# Altium project Michel.PrjPcb (part 2 of 2)

## Sheet PA1_Alim.SchDoc
size 254 x 228 mm
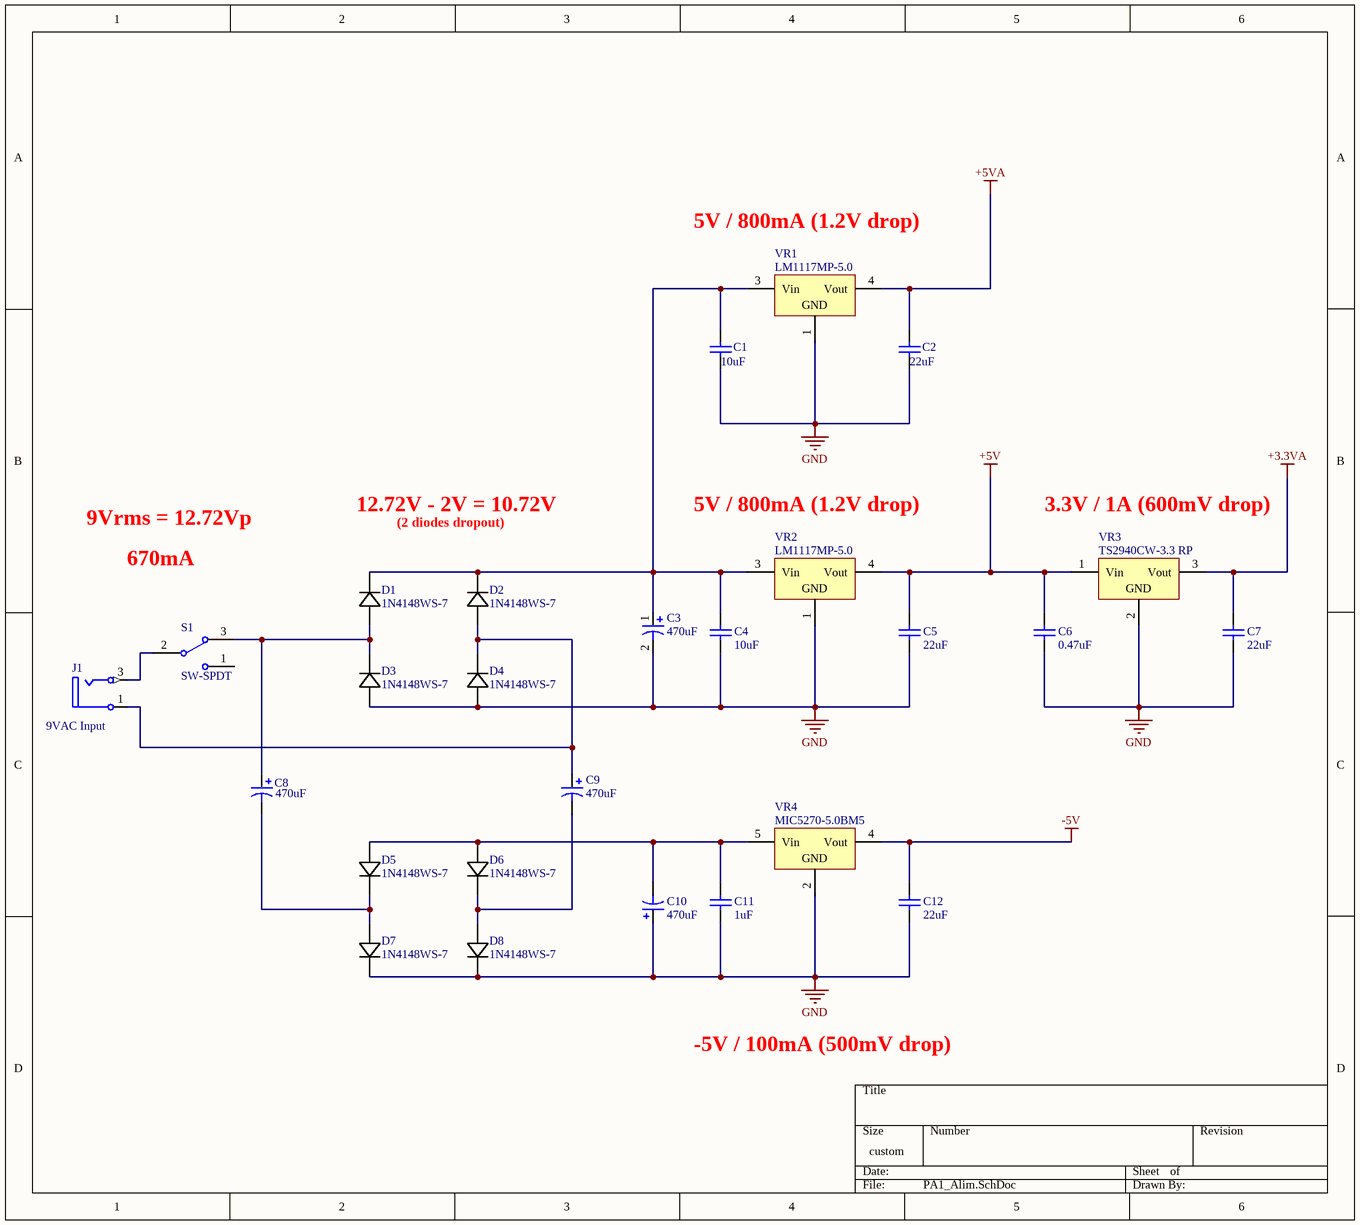
[diagram p6: PA1_Alim.SchDoc]

### Parts
C1  value 10uF  [CAPC1608X08]  (hidden comment: Cap 10uF)
C2  value 22uF  [CAPC1608X08]  (hidden comment: Cap 22uF)
C3  value 470uF  [CAPC100100X102]  (hidden comment: Cap 470uF)
C4  value 10uF  [CAPC1608X08]  (hidden comment: Cap 10uF)
C5  value 22uF  [CAPC1608X08]  (hidden comment: Cap 22uF)
C6  value 0.47uF  [CAPC1608X08]  (hidden comment: Cap 0.47uF)
C7  value 22uF  [CAPC1608X08]  (hidden comment: Cap 22uF)
C8  value 470uF  [CAPC100100X102]  (hidden comment: Cap 470uF)
C9  value 470uF  [CAPC100100X102]  (hidden comment: Cap 470uF)
C10  value 470uF  [CAPC100100X102]  (hidden comment: Cap 470uF)
C11  value 1uF  [CAPC1608X08]  (hidden comment: Cap 1uF)
C12  value 22uF  [CAPC1608X08]  (hidden comment: Cap 22uF)
D1  1N4148WS-7  [SOD323-M]
D2  1N4148WS-7  [SOD323-M]
D3  1N4148WS-7  [SOD323-M]
D4  1N4148WS-7  [SOD323-M]
D5  1N4148WS-7  [SOD323-M]
D6  1N4148WS-7  [SOD323-M]
D7  1N4148WS-7  [SOD323-M]
D8  1N4148WS-7  [SOD323-M]
J1  9VAC Input  [CLIFF ELECTRONIC COMPONENTS_FC681465P]
S1  SW-SPDT  [C&K_TS01ABE]
VR1  LM1117MP-5.0  [MP04A]
VR2  LM1117MP-5.0  [MP04A]
VR3  TS2940CW-3.3 RP  [SOT230P715X180-4N]
VR4  MIC5270-5.0BM5  [SOT95P280X130-5N]

### Nets
+3.3VA: C7.2 VR3.3(Vout)
+5V: C5.2 C6.2 VR2.4(Vout) VR3.1(Vin)
+5VA: C2.2 VR1.4(Vout)
-5V: C12.2 VR4.4(Vout)
GND: C1.1 C2.1 C3.2 C4.1 C5.1 C6.1 C7.1 C10.1 C11.1 C12.1 D3.2 D4.2 D7.1 D8.1 VR1.1(GND) VR2.1(GND) VR3.2(GND) VR4.2(GND)
NetC1_2: C1.2 C3.1 C4.2 D1.1 D2.1 VR1.3(Vin) VR2.3(Vin)
NetC8_1: C8.1 D1.2 D3.1 S1.3
NetC8_2: C8.2 D5.1 D7.2
NetC9_1: C9.1 D2.2 D4.1 J1.1(S)
NetC9_2: C9.2 D6.1 D8.2
NetC10_2: C10.2 C11.2 D5.2 D6.2 VR4.5(Vin)
NetJ1_3: J1.3(T) S1.2

Not connected (* = marked no-connect by the designer): S1 1

### Notes on the sheet
- 5V / 800mA (1.2V drop)
- 9Vrms = 12.72Vp
- 670mA
- 12.72V - 2V = 10.72V
- (2 diodes dropout)
- 3.3V / 1A (600mV drop)
- -5V / 100mA (500mV drop)

### Library data of the parts
C1 C4 = Cap Semi: Capacitor; Fabricant: TDK; Fournisseur: Farnell; RefFabricant: C1608X5R1A106M080AC; RefFournisseur: 2309028; Case: 0603 [1608 Metric]; DataSheet: http://www.farnell.com/datasheets/2291921.pdf
C2 C5 C7 C12 = Cap Semi: Capacitor; Fabricant: MURATA; Fournisseur: Farnell; RefFabricant: GRM188R61A226ME15D; RefFournisseur: 2426957; Case: 0603 [1608 Metric]; DataSheet: http://www.farnell.com/datasheets/2047978.pdf
C3 C8-C10 = Cap Pol1: Polarized Capacitor (Radial); Fabricant: PANASONIC ELECTRONIC COMPONENTS; Fournisseur: Farnell; RefFabricant: EEEFK1E471P; RefFournisseur: 9695800; Case: [10mm]; DataSheet: http://www.farnell.com/datasheets/2002520.pdf
C6 = Cap Semi: Capacitor; Fabricant: TDK; Fournisseur: Farnell; RefFabricant: C1608X5R1H474K080AB; RefFournisseur: 2211183; Case: 0603 [1608 Metric]; DataSheet: http://www.farnell.com/datasheets/2291921.pdf
C11 = Cap Semi: Capacitor; Fabricant: MURATA; Fournisseur: Farnell; RefFabricant: GRM188F51A105ZA01D; RefFournisseur: 1828847; Case: 0603 [1608 Metric]; DataSheet: http://www.farnell.com/datasheets/2048756.pdf
D1-D8 = 1N4148WS-7: Diode signaux faibles; RefFournisseur: 2453269; Fabricant: ON SEMICONDUCTOR; Fournisseur: Farnell; RefFabricant: 1N4148WS; DataSheet: http://www.farnell.com/datasheets/2288055.pdf
J1 = Phonejack2: Jack Socket Thru-Hole Vertical 2-Conductor Open Circuit; Fabricant: CLIFF ELECTRONIC COMPONENTS; Fournisseur: Farnell; RefFabricant: FC681465P; RefFournisseur: 1854512; DataSheet: http://www.farnell.com/datasheets/1855458.pdf
S1 = SW-SPDT: SPDT Subminiature Toggle Switch, Right Angle Mounting, Vertical Actuation; Fabricant: C & K COMPONENTS; Fournisseur: Farnell; RefFabricant: TS01ABE; RefFournisseur: 2435185; DataSheet: http://www.farnell.com/datasheets/1839865.pdf
VR1 VR2 = Volt Reg: Voltage Regulator; Fabricant: TEXAS INSTRUMENTS; Fournisseur: Farnell; RefFournisseur: 9778209; DataSheet: http://www.farnell.com/datasheets/2019100.pdf; RefFabricant: LM1117MP-5.0
VR3 = Volt Reg: Voltage Regulator; Fabricant: TAIWAN SEMICONDUCTOR; Fournisseur: Farnell; RefFournisseur: 7261403; DataSheet: http://www.farnell.com/datasheets/2044143.pdf; RefFabricant: TS2940CW-3.3 RP
VR4 = Volt Reg: Voltage Regulator; Fabricant: MICROCHIP; Fournisseur: Farnell; RefFabricant: MIC5270-5.0YM5-TR; RefFournisseur: 2510308; DataSheet: http://www.farnell.com/datasheets/29611.pdf

## Sheet PP4_pD_GND.SchDoc
size A
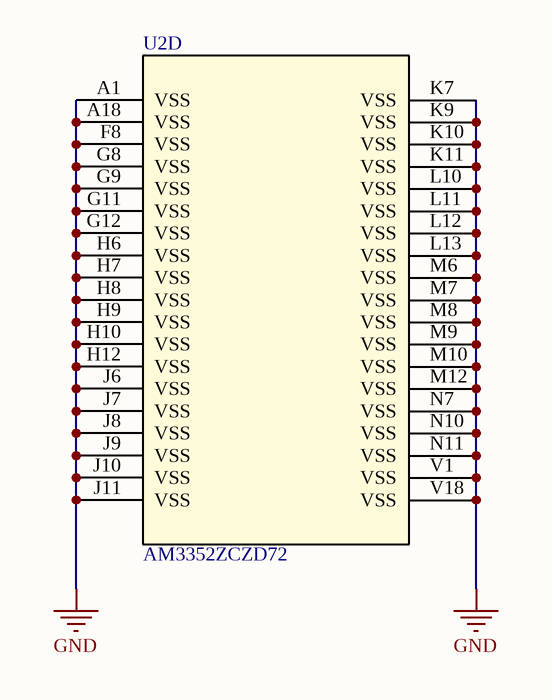
[diagram p7: PP4_pD_GND.SchDoc]

### Parts
U2  AM3352ZCZD72  [ZCZ324]  (part D of 4)

### Nets
GND: U2.A1(VSS) U2.A18(VSS) U2.F8(VSS) U2.G8(VSS) U2.G9(VSS) U2.G11(VSS) U2.G12(VSS) U2.H6(VSS) U2.H7(VSS) U2.H8(VSS) U2.H9(VSS) U2.H10(VSS) U2.H12(VSS) U2.J6(VSS) U2.J7(VSS) U2.J8(VSS) U2.J9(VSS) U2.J10(VSS) U2.J11(VSS) U2.K7(VSS) U2.K9(VSS) U2.K10(VSS) U2.K11(VSS) U2.L10(VSS) U2.L11(VSS) U2.L12(VSS) U2.L13(VSS) U2.M6(VSS) U2.M7(VSS) U2.M8(VSS) U2.M9(VSS) U2.M10(VSS) U2.M12(VSS) U2.N7(VSS) U2.N10(VSS) U2.N11(VSS) U2.V1(VSS) U2.V18(VSS)

### Library data of the parts
U2 = AM3352BZCZD80: Microprocesseur ARM; Fabricant: TEXAS INSTRUMENTS; Fournisseur: Olimex; RefFabricant: AM3352ZCZD72; RefFournisseur: AM3352ZCZD72; DataSheet: http://www.ti.com/lit/ds/symlink/am3352.pdf

## Sheet PP5_MIDI.SchDoc
size 152 x 152 mm
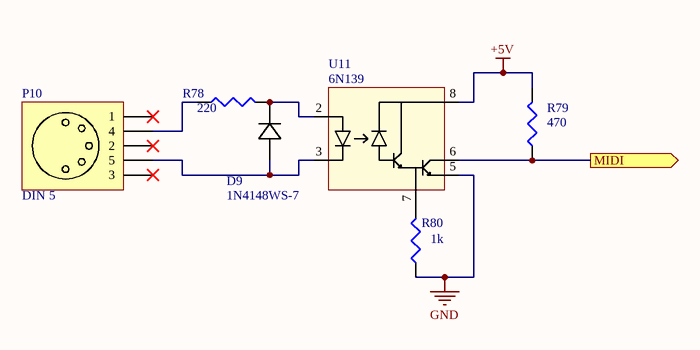
[diagram p8: PP5_MIDI.SchDoc]

### Parts
D9  1N4148WS-7  [SOD323-M]
P10  DIN 5  [PRO SIGNAL_PSG03463]
R78  value 220  [RESC1608X05]  (hidden comment: Cap 220)
R79  value 470  [RESC1608X05]  (hidden comment: Res 470)
R80  value 1k  [RESC1608X05]  (hidden comment: Res 1k)
U11  6N139  [SOIC127P970X356-8N]

### Ports
MIDI (out)

### Nets
+5V: R79.2 U11.8(B1)
GND: R80.1 U11.5(B1)
MIDI: R79.1 U11.6(B1) ; port MIDI
NetD9_1: D9.1 R78.2 U11.2(B2)
NetD9_2: D9.2 P10.5 U11.3(B1)
NetP10_4: P10.4 R78.1
NetR80_2: R80.2 U11.7(B1)

Not connected (* = marked no-connect by the designer): P10 1* 2* 3*

### Library data of the parts
D9 = 1N4148WS-7: Diode signaux faibles; Fabricant: ON SEMICONDUCTOR; Fournisseur: Farnell; RefFournisseur: 2453269; DataSheet: http://www.farnell.com/datasheets/2288055.pdf; RefFabricant: 1N4148WS
P10 = DIN 5pin: Fabricant: PRO SIGNAL; Fournisseur: Farnell; RefFabricant: PSG03463; RefFournisseur: 1791756; DataSheet: http://www.farnell.com/datasheets/1697491.pdf
R78 = Res3: Capacitor; Fabricant: TE CONNECTIVITY; Fournisseur: Farnell; RefFabricant: CRGH0603J220R; RefFournisseur: 2331717; Case: 0603 [1608 Metric]
R79 = Res3: Resistor; Fabricant: TE CONNECTIVITY; Fournisseur: Farnell; RefFabricant: CRGH0603F470R; RefFournisseur: 2331997; Case: 0603 [1608 Metric]
R80 = Res3: Resistor; Fabricant: TE CONNECTIVITY; Fournisseur: Farnell; RefFabricant: CRGH0603F1K0; RefFournisseur: 2332003; Case: 0603 [1608 Metric]; DataSheet: http://www.farnell.com/datasheets/2007183.pdf
U11 = 6N139: Optocoupler; Fabricant: BOADCOM; Fournisseur: Farnell; RefFabricant: 6N139-300E; RefFournisseur: 1085023; DataSheet: http://www.farnell.com/datasheets/1266261.pdf

## Sheet PP7_USB.SchDoc
size 199 x 119 mm
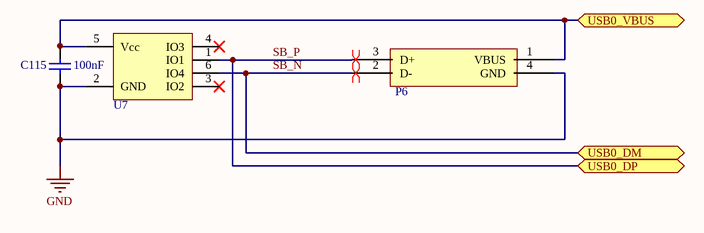
[diagram p9: PP7_USB.SchDoc]

### Parts
C115  value 100nF  [CAPC1608X08]  (hidden comment: Cap 100nF)
P6  1734346-1  [CONN4-292304]  (value not drawn)
U7  TPD4E1U06DBVR  [DBV6-M]  (value not drawn)

### Ports
USB0_DM, USB0_DP, USB0_VBUS

### Nets
GND: C115.2 P6.4(GND) U7.2(GND)
SB_N: P6.2(D-) U7.6(IO4) ; port USB0_DM
SB_P: P6.3(D+) U7.1(IO1) ; port USB0_DP
USB0_VBUS: C115.1 P6.1(VBUS) U7.5(Vcc) ; port USB0_VBUS

Not connected (* = marked no-connect by the designer): U7 3(IO2)* 4(IO3)*

### Layout directives
differential pair; net class SBS: SB_N, SB_P

### Library data of the parts
C115 = Cap Semi: as C39 on sheet PP1_ptA_SRAM-NAND; Case: 0603 [1608 Metric]
P6 = 67068-8010: Connecteur USB-Type-B; Fabricant: TE CONNECTIVITY; RefFournisseur: 1321918; Fournisseur: Farnell; RefFabricant: 1734346-1; DataSheet: http://www.farnell.com/datasheets/2365064.pdf
U7 = TPD4E1U06DBVR: Protection_ESD; RefFournisseur: 2496529; Fournisseur: Farnell; Fabricant: TEXAS INSTRUMENTS; DataSheet: http://www.ti.com/lit/ds/symlink/tpd4e1u06.pdf; RefFabricant: TPD4E1U06DBVR

## Sheet PP8_MMC.SchDoc
size A
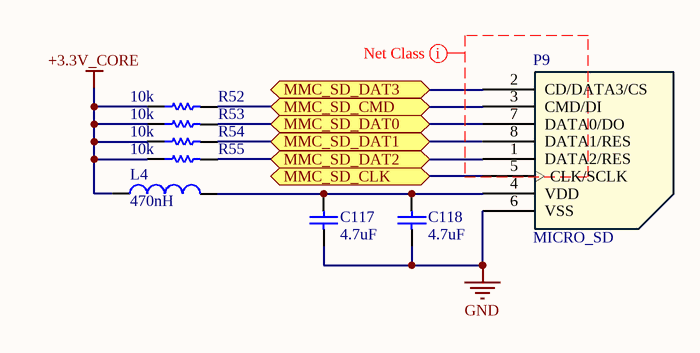
[diagram p10: PP8_MMC.SchDoc]

### Parts
C117  value 4.7uF  [CAPC1608X08]  (hidden comment: Cap 4.7uF)
C118  value 4.7uF  [CAPC1608X08]  (hidden comment: Cap 4.7uF)
L4  value 470nH  [INDM1608X08N]  (hidden comment: Inductor High Frequency)
P9  MICRO_SD  [WURTH ELEKTRONIK_693072010801]
R52  value 10k  [RESC1608X05]  (hidden comment: Res 10k)
R53  value 10k  [RESC1608X05]  (hidden comment: Res 10k)
R54  value 10k  [RESC1608X05]  (hidden comment: Res 10k)
R55  value 10k  [RESC1608X05]  (hidden comment: Res 10k)

### Ports
MMC_SD_CLK, MMC_SD_CMD, MMC_SD_DAT0, MMC_SD_DAT1, MMC_SD_DAT2, MMC_SD_DAT3

### Nets
+3.3V_CORE: L4.1 R52.1 R53.1 R54.1 R55.1
GND: C117.1 C118.2 P9.6(VSS)
SD_CLK: P9.5(CLK/SCLK) ; port MMC_SD_CLK
SD_CMD: P9.3(CMD/DI) R52.2 ; port MMC_SD_CMD
SD_DAT0: P9.7(DATA0/DO) R53.2 ; port MMC_SD_DAT0
SD_DAT1: P9.8(DATA1/RES) R54.2 ; port MMC_SD_DAT1
SD_DAT2: P9.1(DATA2/RES) R55.2 ; port MMC_SD_DAT2
SD_DAT3: P9.2(CD/DATA3/CS) ; port MMC_SD_DAT3
NetC117_2: C117.2 C118.1 L4.2 P9.4(VDD)

### Layout directives
net class MMC: (no net found under the mark)

### Library data of the parts
C117 C118 = Cap: Capacitor; Fabricant: MURATA; Fournisseur: Farnell; RefFabricant: GRT188R61E475KE13D; RefFournisseur: 2672159; DataSheet: http://www.farnell.com/datasheets/2165958.pdf; Case: 0603 [1608 Metric]
L4 = Inductor: Fabricant: WURTH ELEKTRONIK; Fournisseur: Farnell; RefFournisseur: 2424740; RefFabricant: 744786247A; DataSheet: http://www.farnell.com/datasheets/1818786.pdf; Case: 0603 [1608 Metric]
P9 = MicroSD: Embase mémoire; Fournisseur: Farnell; Fabricant: WURTH ELEKTRONIK; RefFabricant: 693072010801; RefFournisseur: 2081364; DataSheet: http://www.farnell.com/datasheets/1912449.pdf
R52-R55 = Res1: Resistor; Fabricant: TE CONNECTIVITY; Fournisseur: Farnell; RefFabricant: CRGH0603J10K; RefFournisseur: 2331740; Case: 0603 [1608 Metric]; DataSheet: CRGH0603J10K

## Sheet PC4_AudioInput.SchDoc
size 254 x 241 mm
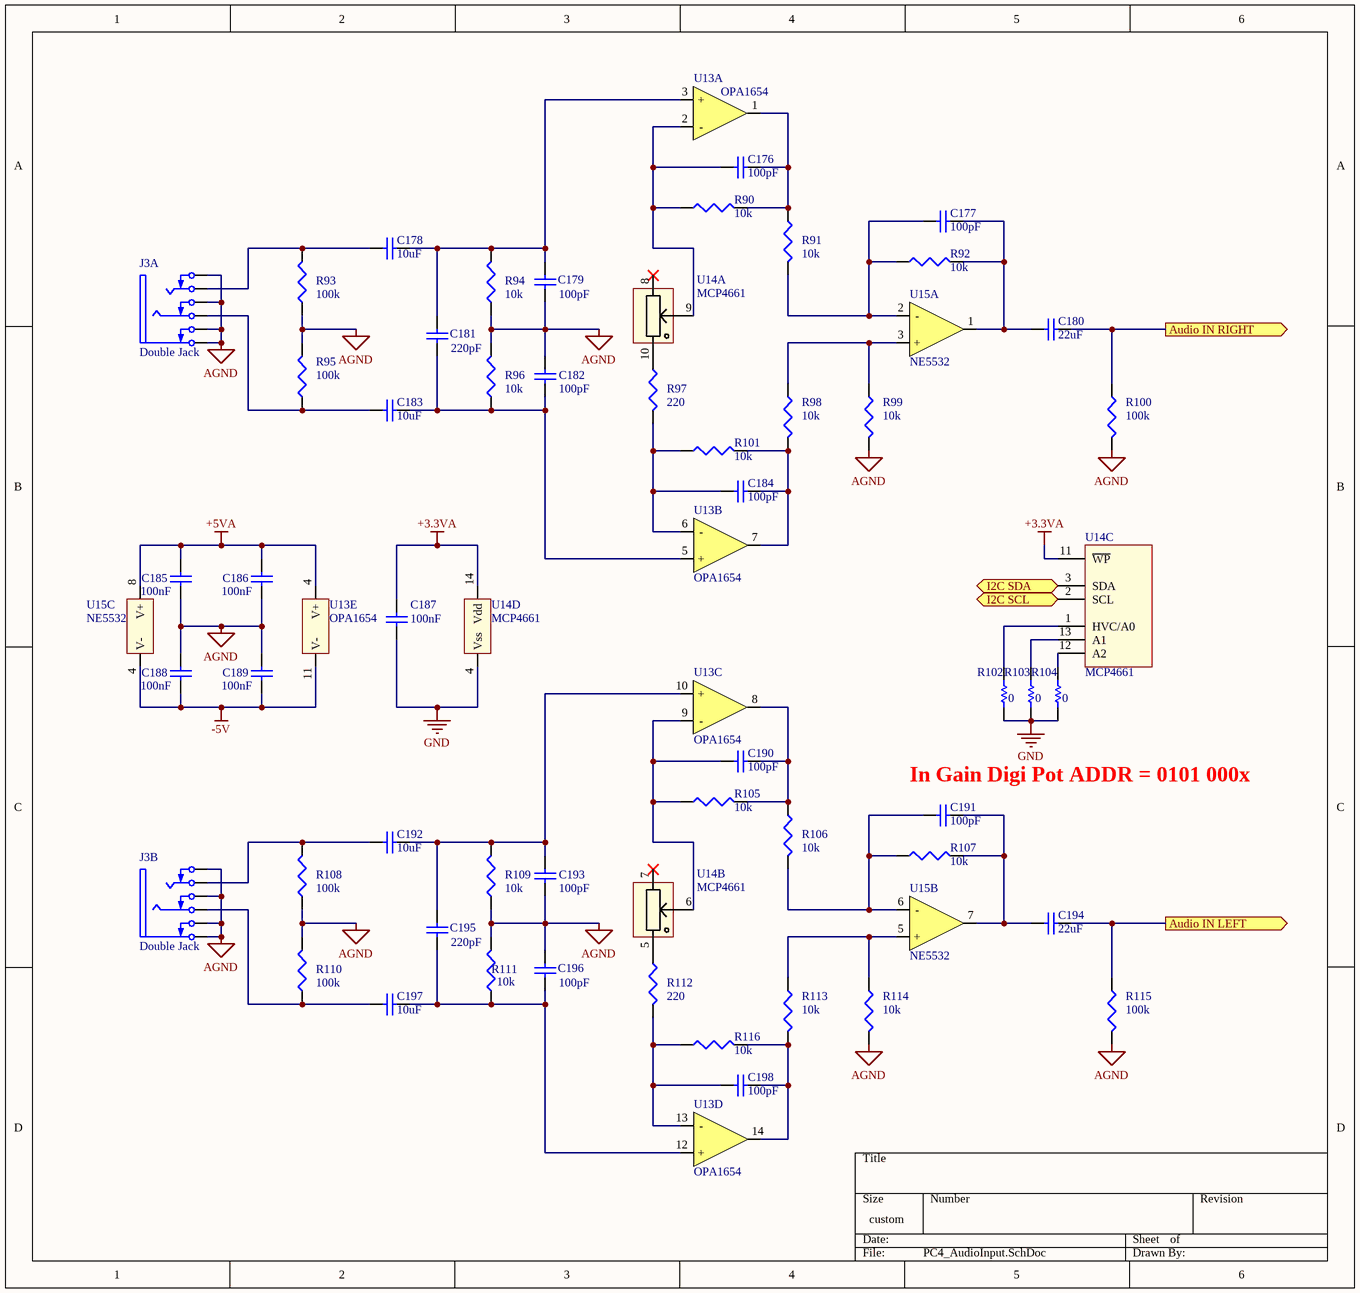
[diagram p11: PC4_AudioInput.SchDoc]

### Parts
C176  value 100pF  [CAPC1608X08]  (hidden comment: Cap 100pF)
C177  value 100pF  [CAPC1608X08]  (hidden comment: Cap 100pF)
C178  value 10uF  [CAPC1608X08]  (hidden comment: Cap 10uF)
C179  value 100pF  [CAPC1608X08]  (hidden comment: Cap 100pF)
C180  value 22uF  [CAPC1608X08]  (hidden comment: Cap 22uF)
C181  value 220pF  [CAPC1608X08]  (hidden comment: Cap 220pF)
C182  value 100pF  [CAPC1608X08]  (hidden comment: Cap 100pF)
C183  value 10uF  [CAPC1608X08]  (hidden comment: Cap 10uF)
C184  value 100pF  [CAPC1608X08]  (hidden comment: Cap 100pF)
C185  value 100nF  [CAPC1608X08]  (hidden comment: Cap 100nF)
C186  value 100nF  [CAPC1608X08]  (hidden comment: Cap 100nF)
C187  value 100nF  [CAPC1608X08]  (hidden comment: Cap 100nF)
C188  value 100nF  [CAPC1608X08]  (hidden comment: Cap 100nF)
C189  value 100nF  [CAPC1608X08]  (hidden comment: Cap 100nF)
C190  value 100pF  [CAPC1608X08]  (hidden comment: Cap 100pF)
C191  value 100pF  [CAPC1608X08]  (hidden comment: Cap 100pF)
C192  value 10uF  [CAPC1608X08]  (hidden comment: Cap 10uF)
C193  value 100pF  [CAPC1608X08]  (hidden comment: Cap 100pF)
C194  value 22uF  [CAPC1608X08]  (hidden comment: Cap 22uF)
C195  value 220pF  [CAPC1608X08]  (hidden comment: Cap 220pF)
C196  value 100pF  [CAPC1608X08]  (hidden comment: Cap 100pF)
C197  value 10uF  [CAPC1608X08]  (hidden comment: Cap 10uF)
C198  value 100pF  [CAPC1608X08]  (hidden comment: Cap 100pF)
J3  Double Jack  [Amphenol_ACJS-MHDC]  (parts A,B of 2)
R90  value 10k  [RESC1608X05]  (hidden comment: Res 10k)
R91  value 10k  [RESC1608X05]  (hidden comment: Res 10k)
R92  value 10k  [RESC1608X05]  (hidden comment: Res 10k)
R93  value 100k  [RESC1608X05]  (hidden comment: Res 100k)
R94  value 10k  [RESC1608X05]  (hidden comment: Res 10k)
R95  value 100k  [RESC1608X05]  (hidden comment: Res 100k)
R96  value 10k  [RESC1608X05]  (hidden comment: Res 10k)
R97  value 220  [RESC1608X05]  (hidden comment: Cap 220)
R98  value 10k  [RESC1608X05]  (hidden comment: Res 10k)
R99  value 10k  [RESC1608X05]  (hidden comment: Res 10k)
R100  value 100k  [RESC1608X05]  (hidden comment: Res 100k)
R101  value 10k  [RESC1608X05]  (hidden comment: Res 10k)
R102  value 0  [RESC1608X05]  (hidden comment: Res 0 Ohm)
R103  value 0  [RESC1608X05]  (hidden comment: Res 0 Ohm)
R104  value 0  [RESC1608X05]  (hidden comment: Res 0 Ohm)
R105  value 10k  [RESC1608X05]  (hidden comment: Res 10k)
R106  value 10k  [RESC1608X05]  (hidden comment: Res 10k)
R107  value 10k  [RESC1608X05]  (hidden comment: Res 10k)
R108  value 100k  [RESC1608X05]  (hidden comment: Res 100k)
R109  value 10k  [RESC1608X05]  (hidden comment: Res 10k)
R110  value 100k  [RESC1608X05]  (hidden comment: Res 100k)
R111  value 10k  [RESC1608X05]  (hidden comment: Res 10k)
R112  value 220  [RESC1608X05]  (hidden comment: Cap 220)
R113  value 10k  [RESC1608X05]  (hidden comment: Res 10k)
R114  value 10k  [RESC1608X05]  (hidden comment: Res 10k)
R115  value 100k  [RESC1608X05]  (hidden comment: Res 100k)
R116  value 10k  [RESC1608X05]  (hidden comment: Res 10k)
U13  OPA1654  [D14-M]  (parts A,B,C,D,E of 5)
U14  MCP4661  [TSSOP14_MC-M]  (parts A,B,C,D of 4)
U15  NE5532  [D8-M]  (parts A,B,C of 3)

### Ports
Audio IN LEFT (out), Audio IN RIGHT (out), I2C SCL, I2C SDA

### Nets
+3.3VA: C187.1 U14.11(~{WP}) U14.14(Vdd)
+5VA: C185.1 C186.1 U13.4(V+) U15.8(V+)
-5V: C188.2 C189.2 U13.11(V-) U15.4(V-)
AGND: C179.2 C182.1 C185.2 C186.2 C188.1 C189.1 C193.2 C196.1 J3.1(SB) J3.2(RB) J3.3(TB) J3.4(S) J3.7(SB) J3.8(RB) J3.9(TB) J3.10(S) R93.1 R94.1 R95.2 R96.2 R99.2 R100.2 R108.1 R109.1 R110.2 R111.2 R114.2 R115.2
GND: C187.2 R102.1 R103.1 R104.1 U14.4(Vss)
Audio IN LEFT: C194.1 R115.1 ; port Audio IN LEFT
Audio IN RIGHT: C180.1 R100.1 ; port Audio IN RIGHT
I2C2_SCL: U14.2(SCL) ; port I2C SCL
I2C2_SDA: U14.3(SDA) ; port I2C SDA
NetC176_1: C176.1 R90.1 U13.2(-) U14.9(P0W)
NetC176_2: C176.2 R90.2 R91.1 U13.1(OUT)
NetC177_1: C177.1 R91.2 R92.1 U15.2(-)
NetC177_2: C177.2 C180.2 R92.2 U15.1(OUT)
NetC178_1: C178.1 C179.1 C181.1 R94.2 U13.3(+)
NetC178_2: C178.2 J3.12(T) R93.2
NetC181_2: C181.2 C182.2 C183.1 R96.1 U13.5(+)
NetC183_2: C183.2 J3.11(R) R95.1
NetC184_1: C184.1 R97.2 R101.1 U13.6(-)
NetC184_2: C184.2 R98.2 R101.2 U13.7(OUT)
NetC190_1: C190.1 R105.1 U13.9(-) U14.6(P1W)
NetC190_2: C190.2 R105.2 R106.1 U13.8(OUT)
NetC191_1: C191.1 R106.2 R107.1 U15.6(-)
NetC191_2: C191.2 C194.2 R107.2 U15.7(OUT)
NetC192_1: C192.1 C193.1 C195.1 R109.2 U13.10(+)
NetC192_2: C192.2 J3.6(T) R108.2
NetC195_2: C195.2 C196.2 C197.1 R111.1 U13.12(+)
NetC197_2: C197.2 J3.5(R) R110.1
NetC198_1: C198.1 R112.2 R116.1 U13.13(-)
NetC198_2: C198.2 R113.2 R116.2 U13.14(OUT)
NetR97_1: R97.1 U14.10(P0B)
NetR98_1: R98.1 R99.1 U15.3(+)
NetR102_2: R102.2 U14.1(HVC/A0)
NetR103_2: R103.2 U14.13(A1)
NetR104_2: R104.2 U14.12(A2)
NetR112_1: R112.1 U14.5(P1B)
NetR113_1: R113.1 R114.1 U15.5(+)

Not connected (* = marked no-connect by the designer): U14 7(P1A)* 8(P0A)*

### Notes on the sheet
- (near C191) In Gain Digi Pot ADDR = 0101 000x

### Library data of the parts
C176 C177 C179 C182 C184 C190 C191 C193 C196 C198 = Cap Semi: Capacitor; Fabricant: MULTICOMP; Fournisseur: Farnell; RefFabricant: MCMT18N101F250CT; RefFournisseur: 1856128; Case: 0603 [1608 Metric]; DataSheet: http://www.farnell.com/datasheets/1825496.pdf
C178 C183 C192 C197 = Cap Semi: Capacitor; Fabricant: TDK; Fournisseur: Farnell; RefFabricant: C1608X5R1A106M080AC; RefFournisseur: 2309028; Case: 0603 [1608 Metric]; DataSheet: http://www.farnell.com/datasheets/2291921.pdf
C180 C194 = Cap Semi: Capacitor; Fabricant: MURATA; Fournisseur: Farnell; RefFabricant: GRM188R61A226ME15D; RefFournisseur: 2426957; Case: 0603 [1608 Metric]; DataSheet: http://www.farnell.com/datasheets/2047978.pdf
C181 C195 = Cap Semi: Capacitor; Fabricant: YAGEO; Fournisseur: Farnell; RefFabricant: CC0603JRNPO9BN221; RefFournisseur: 430948; Case: 0603 [1608 Metric]; DataSheet: http://www.farnell.com/datasheets/2213336.pdf
C185-C189 = Cap Semi: Capacitor; Fabricant: KEMET; Fournisseur: Farnell; RefFabricant: C0603T104K5RALTU; RefFournisseur: 2522432; Case: 0603 [1608 Metric]
J3 = Dual TRS Jack Bypassed: Dual Jack stereo bypassed; Fabricant: AMPHENOL; Fournisseur: Farnell; RefFabricant: ACJS-MHDC; RefFournisseur: 2771861; DataSheet: http://www.farnell.com/datasheets/866888.pdf
R90-R92 R94 R96 R98 R99 R101 R105-R107 R109 R111 R113 R114 R116 = Res3: Resistor; Fabricant: TE CONNECTIVITY; Fournisseur: Farnell; RefFabricant: CRGH0603J10K; RefFournisseur: 2331740; Case: 0603 [1608 Metric]; DataSheet: CRGH0603J10K
R93 R95 R100 R108 R110 R115 = Res3: Resistor; Fabricant: TE CONNECTIVITY; Fournisseur: Farnell; RefFabricant: RN73C1J100KBTDF; RefFournisseur: 2687850; Case: 0603 [1608 Metric]; DataSheet: http://www.farnell.com/datasheets/2189072.pdf
R97 R112 = Res3: Capacitor; Fabricant: TE CONNECTIVITY; Fournisseur: Farnell; RefFabricant: CRGH0603J220R; RefFournisseur: 2331717; Case: 0603 [1608 Metric]
R102-R104 = Res1: Resistor; Fabricant: VISHAY; Fournisseur: Farnell; RefFabricant: CRCW06030000Z0EB; RefFournisseur: 2616741; Case: 0603 [1608 Metric]
U13 = OPA1654: Quad Audio OpAmp; Fabricant: TEXAS INSTRUMENTS; RefFournisseur: 2099889; Fournisseur: Farnell; RefFabricant: OPA1654; DataSheet: http://www.ti.com/lit/ds/symlink/opa1654.pdf
U14 = MCP4661: Dual DigiPot non volatile I2C; RefFournisseur: 1840724; RefFabricant: MCP4661-503E/ST; Fournisseur: Farnell; Fabricant: MICROCHIP; DataSheet: http://www.farnell.com/datasheets/2243913.pdf
U15 = NE5532: Dual Audio OpAmp; Fournisseur: Farnell; RefFournisseur: 1426379; RefFabricant: NE5532AD8G; Fabricant: ON SEMICONDUCTOR; DataSheet: http://www.farnell.com/datasheets/1777901.pdf

## Sheet PC5_AudioOutput.SchDoc
size A
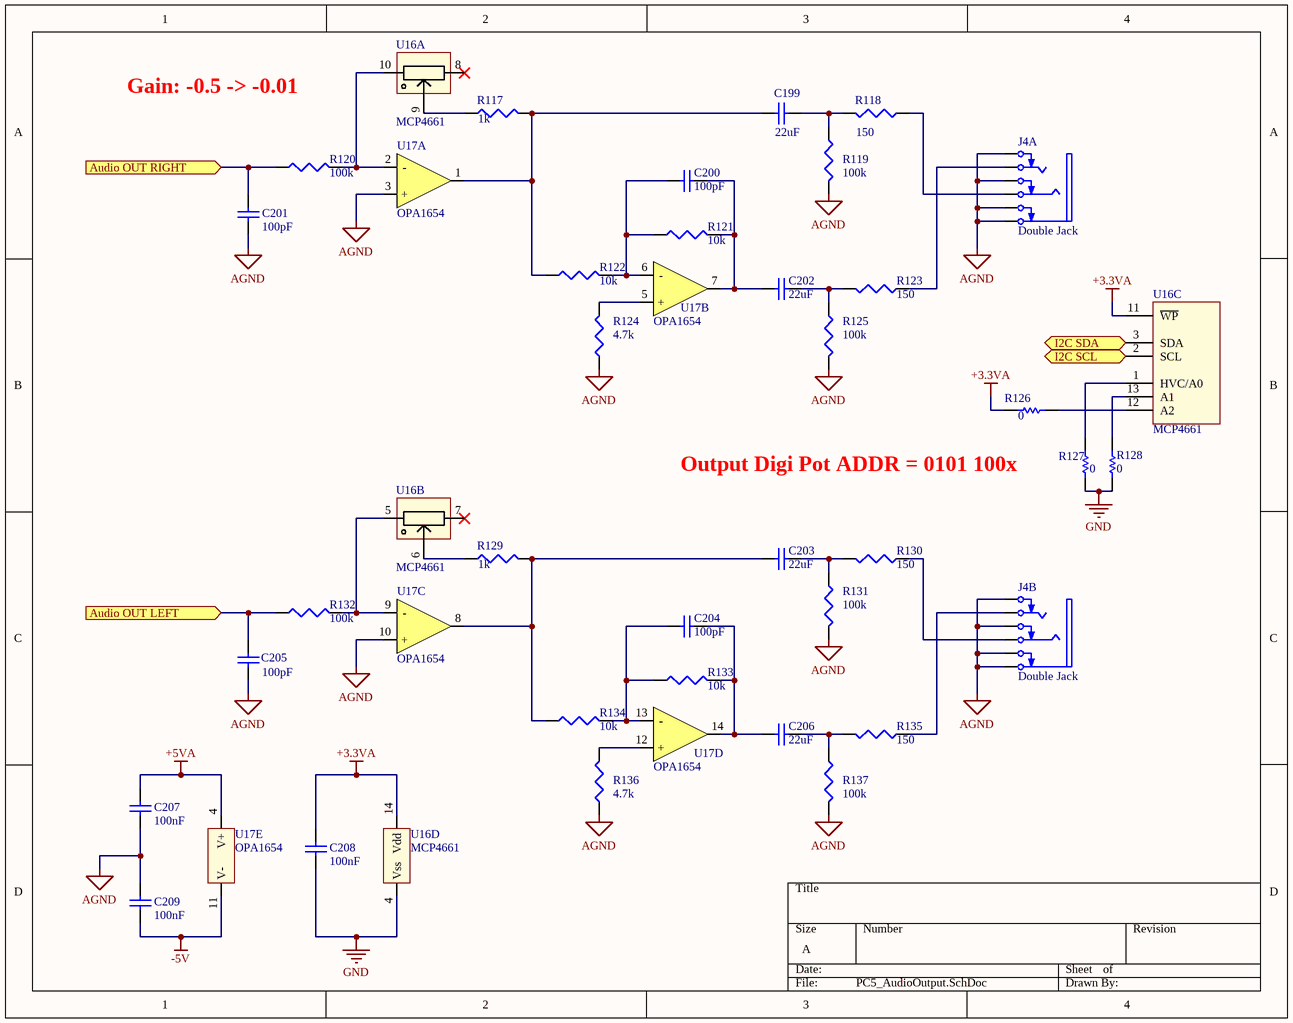
[diagram p12: PC5_AudioOutput.SchDoc]

### Parts
C199  value 22uF  [CAPC1608X08]  (hidden comment: Cap 22uF)
C200  value 100pF  [CAPC1608X08]  (hidden comment: Cap 100pF)
C201  value 100pF  [CAPC1608X08]  (hidden comment: Cap 100pF)
C202  value 22uF  [CAPC1608X08]  (hidden comment: Cap 22uF)
C203  value 22uF  [CAPC1608X08]  (hidden comment: Cap 22uF)
C204  value 100pF  [CAPC1608X08]  (hidden comment: Cap 100pF)
C205  value 100pF  [CAPC1608X08]  (hidden comment: Cap 100pF)
C206  value 22uF  [CAPC1608X08]  (hidden comment: Cap 22uF)
C207  value 100nF  [CAPC1608X08]  (hidden comment: Cap 100nF)
C208  value 100nF  [CAPC1608X08]  (hidden comment: Cap 100nF)
C209  value 100nF  [CAPC1608X08]  (hidden comment: Cap 100nF)
J4  Double Jack  [Amphenol_ACJS-MHDC]  (parts A,B of 2)
R117  value 1k  [RESC1608X05]  (hidden comment: Res 1k)
R118  value 150  [RESC1608X05]  (hidden comment: Cap 150)
R119  value 100k  [RESC1608X05]  (hidden comment: Res 100k)
R120  value 100k  [RESC1608X05]  (hidden comment: Res 100k)
R121  value 10k  [RESC1608X05]  (hidden comment: Res 10k)
R122  value 10k  [RESC1608X05]  (hidden comment: Res 10k)
R123  value 150  [RESC1608X05]  (hidden comment: Cap 150)
R124  value 4.7k  [RESC1608X05]  (hidden comment: Res 4.7k)
R125  value 100k  [RESC1608X05]  (hidden comment: Res 100k)
R126  value 0  [RESC1608X05]  (hidden comment: Res 0 Ohm)
R127  value 0  [RESC1608X05]  (hidden comment: Res 0 Ohm)
R128  value 0  [RESC1608X05]  (hidden comment: Res 0 Ohm)
R129  value 1k  [RESC1608X05]  (hidden comment: Res 1k)
R130  value 150  [RESC1608X05]  (hidden comment: Cap 150)
R131  value 100k  [RESC1608X05]  (hidden comment: Res 100k)
R132  value 100k  [RESC1608X05]  (hidden comment: Res 100k)
R133  value 10k  [RESC1608X05]  (hidden comment: Res 10k)
R134  value 10k  [RESC1608X05]  (hidden comment: Res 10k)
R135  value 150  [RESC1608X05]  (hidden comment: Cap 150)
R136  value 4.7k  [RESC1608X05]  (hidden comment: Res 4.7k)
R137  value 100k  [RESC1608X05]  (hidden comment: Res 100k)
U16  MCP4661  [TSSOP14_MC-M]  (parts A,B,C,D of 4)
U17  OPA1654  [D14-M]  (parts A,B,C,D,E of 5)

### Ports
Audio OUT LEFT (in), Audio OUT RIGHT (in), I2C SCL, I2C SDA

### Nets
+3.3VA: C208.1 R126.1 U16.11(~{WP}) U16.14(Vdd)
+5VA: C207.1 U17.4(V+)
-5V: C209.2 U17.11(V-)
AGND: C201.1 C205.1 C207.2 C209.1 J4.1(SB) J4.2(RB) J4.3(TB) J4.4(S) J4.7(SB) J4.8(RB) J4.9(TB) J4.10(S) R119.2 R124.1 R125.2 R131.2 R136.1 R137.2 U17.3(+) U17.10(+)
GND: C208.2 R127.1 R128.1 U16.4(Vss)
I2C2_SCL: U16.2(SCL) ; port I2C SCL
I2C2_SDA: U16.3(SDA) ; port I2C SDA
NetC199_1: C199.1 R118.2 R119.1
NetC199_2: C199.2 R117.2 R122.1 U17.1(OUT)
NetC200_1: C200.1 C202.2 R121.2 U17.7(OUT)
NetC200_2: C200.2 R121.1 R122.2 U17.6(-)
NetC201_2: C201.2 R120.1 ; port Audio OUT RIGHT
NetC202_1: C202.1 R123.2 R125.1
NetC203_1: C203.1 R130.2 R131.1
NetC203_2: C203.2 R129.2 R134.1 U17.8(OUT)
NetC204_1: C204.1 C206.2 R133.2 U17.14(OUT)
NetC204_2: C204.2 R133.1 R134.2 U17.13(-)
NetC205_2: C205.2 R132.1 ; port Audio OUT LEFT
NetC206_1: C206.1 R135.2 R137.1
NetJ4_5: J4.5(R) R130.1
NetJ4_6: J4.6(T) R135.1
NetJ4_11: J4.11(R) R118.1
NetJ4_12: J4.12(T) R123.1
NetR117_1: R117.1 U16.9(P0W)
NetR120_2: R120.2 U16.10(P0B) U17.2(-)
NetR124_2: R124.2 U17.5(+)
NetR126_2: R126.2 U16.12(A2)
NetR127_2: R127.2 U16.1(HVC/A0)
NetR128_2: R128.2 U16.13(A1)
NetR129_1: R129.1 U16.6(P1W)
NetR132_2: R132.2 U16.5(P1B) U17.9(-)
NetR136_2: R136.2 U17.12(+)

Not connected (* = marked no-connect by the designer): U16 7(P1A)* 8(P0A)*

### Notes on the sheet
- Gain: -0.5 -> -0.01
- Output Digi Pot ADDR = 0101 100x

### Library data of the parts
C199 C202 C203 C206 = Cap Semi: as C180 on sheet PC4_AudioInput; Case: 0603 [1608 Metric]; DataSheet: http://www.farnell.com/datasheets/2047978.pdf
C200 C201 C204 C205 = Cap Semi: as C176 on sheet PC4_AudioInput; Case: 0603 [1608 Metric]; DataSheet: http://www.farnell.com/datasheets/1825496.pdf
C207-C209 = Cap Semi: as C185-C189 on sheet PC4_AudioInput; Case: 0603 [1608 Metric]
J4 = Dual TRS Jack Bypassed: as J3 on sheet PC4_AudioInput; DataSheet: http://www.farnell.com/datasheets/866888.pdf
R117 R129 = Res3: Resistor; Fabricant: TE CONNECTIVITY; Fournisseur: Farnell; RefFabricant: CRGH0603F1K0; RefFournisseur: 2332003; Case: 0603 [1608 Metric]; DataSheet: http://www.farnell.com/datasheets/2007183.pdf
R118 R123 R130 R135 = Res3: Capacitor; Fabricant: TE CONNECTIVITY; Fournisseur: Farnell; RefFabricant: CRGH0603J150R; RefFournisseur: 2331715; Case: 0603 [1608 Metric]
R119 R120 R125 R131 R132 R137 = Res3: as R93 on sheet PC4_AudioInput; Case: 0603 [1608 Metric]; DataSheet: http://www.farnell.com/datasheets/2189072.pdf
R121 R122 R133 R134 = Res3: as R90 on sheet PC4_AudioInput; Case: 0603 [1608 Metric]; DataSheet: CRGH0603J10K
R124 R136 = Res3: Resistor; Fabricant: TE CONNECTIVITY; Fournisseur: Farnell; RefFabricant: CRGH0603J4K7; RefFournisseur: 2331736; Case: 0603 [1608 Metric]; DataSheet: http://www.farnell.com/datasheets/2007183.pdf
R126-R128 = Res1: as R102-R104 on sheet PC4_AudioInput; Case: 0603 [1608 Metric]
U16 = MCP4661: as U14 on sheet PC4_AudioInput; DataSheet: http://www.farnell.com/datasheets/2243913.pdf
U17 = OPA1654: as U13 on sheet PC4_AudioInput; RefFabricant: OPA1654; DataSheet: http://www.ti.com/lit/ds/symlink/opa1654.pdf

## Sheet PC0_Codec.SchDoc
size 381 x 241 mm
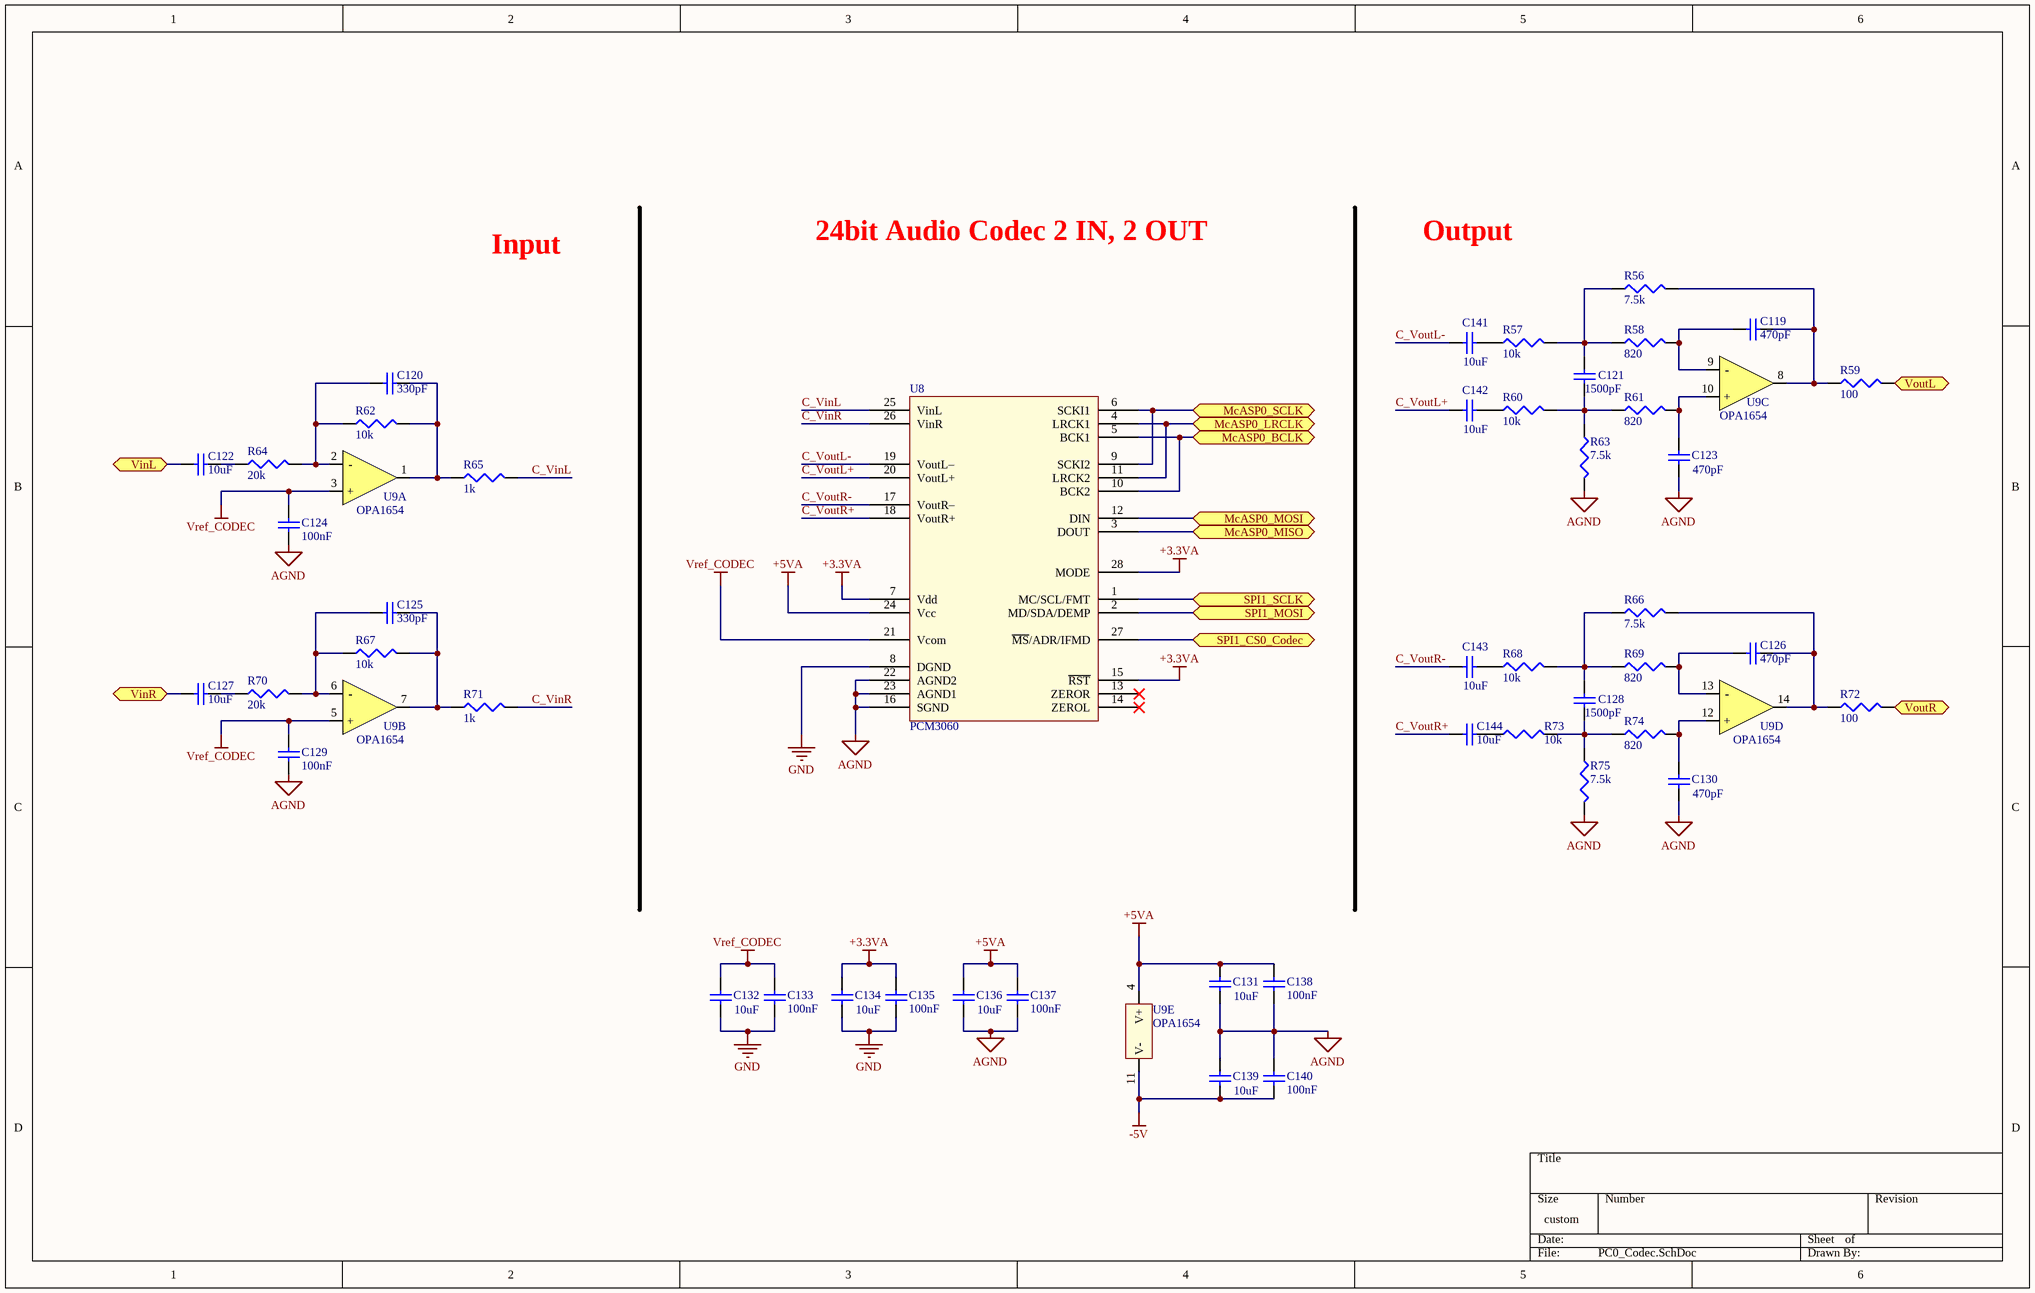
[diagram p13: PC0_Codec.SchDoc]

### Parts
C119  value 470pF  [CAPC1608X08]  (hidden comment: Cap 470pF)
C120  value 330pF  [CAPC1608X08]  (hidden comment: Cap 330pF)
C121  value 1500pF  [CAPC1608X08]  (hidden comment: Cap 1500pF)
C122  value 10uF  [CAPC1608X08]  (hidden comment: Cap 10uF)
C123  value 470pF  [CAPC1608X08]  (hidden comment: Cap 470pF)
C124  value 100nF  [CAPC1608X08]  (hidden comment: Cap 100nF)
C125  value 330pF  [CAPC1608X08]  (hidden comment: Cap 330pF)
C126  value 470pF  [CAPC1608X08]  (hidden comment: Cap 470pF)
C127  value 10uF  [CAPC1608X08]  (hidden comment: Cap 10uF)
C128  value 1500pF  [CAPC1608X08]  (hidden comment: Cap 1500pF)
C129  value 100nF  [CAPC1608X08]  (hidden comment: Cap 100nF)
C130  value 470pF  [CAPC1608X08]  (hidden comment: Cap 470pF)
C131  value 10uF  [CAPC1608X08]  (hidden comment: Cap 10uF)
C132  value 10uF  [CAPC1608X08]  (hidden comment: Cap 10uF)
C133  value 100nF  [CAPC1608X08]  (hidden comment: Cap 100nF)
C134  value 10uF  [CAPC1608X08]  (hidden comment: Cap 10uF)
C135  value 100nF  [CAPC1608X08]  (hidden comment: Cap 100nF)
C136  value 10uF  [CAPC1608X08]  (hidden comment: Cap 10uF)
C137  value 100nF  [CAPC1608X08]  (hidden comment: Cap 100nF)
C138  value 100nF  [CAPC1608X08]  (hidden comment: Cap 100nF)
C139  value 10uF  [CAPC1608X08]  (hidden comment: Cap 10uF)
C140  value 100nF  [CAPC1608X08]  (hidden comment: Cap 100nF)
C141  value 10uF  [CAPC1608X08]  (hidden comment: Cap 10uF)
C142  value 10uF  [CAPC1608X08]  (hidden comment: Cap 10uF)
C143  value 10uF  [CAPC1608X08]  (hidden comment: Cap 10uF)
C144  value 10uF  [CAPC1608X08]  (hidden comment: Cap 10uF)
R56  value 7.5k  [RESC1608X05]  (hidden comment: Res 7.5k)
R57  value 10k  [RESC1608X05]  (hidden comment: Res 10k)
R58  value 820  [RESC1608X05]  (hidden comment: Res 820)
R59  value 100  [RESC1608X05]  (hidden comment: Res 100)
R60  value 10k  [RESC1608X05]  (hidden comment: Res 10k)
R61  value 820  [RESC1608X05]  (hidden comment: Res 820)
R62  value 10k  [RESC1608X05]  (hidden comment: Res 10k)
R63  value 7.5k  [RESC1608X05]  (hidden comment: Res 7.5k)
R64  value 20k  [RESC1608X05]  (hidden comment: Res 20k)
R65  value 1k  [RESC1608X05]  (hidden comment: Res 1k)
R66  value 7.5k  [RESC1608X05]  (hidden comment: Res 7.5k)
R67  value 10k  [RESC1608X05]  (hidden comment: Res 10k)
R68  value 10k  [RESC1608X05]  (hidden comment: Res 10k)
R69  value 820  [RESC1608X05]  (hidden comment: Res 820)
R70  value 20k  [RESC1608X05]  (hidden comment: Res 20k)
R71  value 1k  [RESC1608X05]  (hidden comment: Res 1k)
R72  value 100  [RESC1608X05]  (hidden comment: Res 100)
R73  value 10k  [RESC1608X05]  (hidden comment: Res 10k)
R74  value 820  [RESC1608X05]  (hidden comment: Res 820)
R75  value 7.5k  [RESC1608X05]  (hidden comment: Res 7.5k)
U8  PCM3060  [TSSOP28_PCM3060]
U9  OPA1654  [D14-M]  (parts A,B,C,D,E of 5)

### Ports
McASP0_BCLK, McASP0_LRCLK, McASP0_MISO, McASP0_MOSI, McASP0_SCLK, SPI1_CS0_Codec, SPI1_MOSI, SPI1_SCLK, VinL, VinR, VoutL, VoutR

### Nets
+3.3VA: C134.1 C135.2 U8.7(Vdd) U8.15(~{RST}) U8.28(MODE)
+5VA: C131.1 C136.1 C137.2 C138.2 U8.24(Vcc) U9.4(V+)
-5V: C139.2 C140.1 U9.11(V-)
AGND: C123.2 C124.2 C129.2 C130.2 C131.2 C136.2 C137.1 C138.1 C139.1 C140.2 R63.2 R75.2 U8.16(SGND) U8.22(AGND2) U8.23(AGND1)
GND: C132.2 C133.1 C134.2 C135.1 U8.8(DGND)
Vref_CODEC: C124.1 C129.1 C132.1 C133.2 U8.21(Vcom) U9.3(+) U9.5(+)
Audio IN LEFT: C122.2 ; port VinL
Audio IN RIGHT: C127.2 ; port VinR
Audio OUT LEFT: R59.2 ; port VoutL
Audio OUT RIGHT: R72.2 ; port VoutR
C_VinL: R65.2 U8.25(VinL)
C_VinR: R71.2 U8.26(VinR)
C_VoutL+: C142.2 U8.20(VoutL+)
C_VoutL-: C141.2 U8.19(VoutL–)
C_VoutR+: C144.2 U8.18(VoutR+)
C_VoutR-: C143.2 U8.17(VoutR–)
McASP0_BCLK: U8.5(BCK1) U8.10(BCK2) ; port McASP0_BCLK
McASP0_LRCLK: U8.4(LRCK1) U8.11(LRCK2) ; port McASP0_LRCLK
McASP0_MISO: U8.3(DOUT) ; port McASP0_MISO
McASP0_MOSI: U8.12(DIN) ; port McASP0_MOSI
McASP0_SCLK: U8.6(SCKI1) U8.9(SCKI2) ; port McASP0_SCLK
SPI1_CS0_Codec: U8.27(~{MS}/ADR/IFMD) ; port SPI1_CS0_Codec
SPI1_MOSI: U8.2(MD/SDA/DEMP) ; port SPI1_MOSI
SPI1_SCLK: U8.1(MC/SCL/FMT) ; port SPI1_SCLK
NetC119_1: C119.1 R56.2 R59.1 U9.8(OUT)
NetC119_2: C119.2 R58.2 U9.9(-)
NetC120_1: C120.1 R62.2 R65.1 U9.1(OUT)
NetC120_2: C120.2 R62.1 R64.2 U9.2(-)
NetC121_1: C121.1 R60.2 R61.1 R63.1
NetC121_2: C121.2 R56.1 R57.2 R58.1
NetC122_1: C122.1 R64.1
NetC123_1: C123.1 R61.2 U9.10(+)
NetC125_1: C125.1 R67.2 R71.1 U9.7(OUT)
NetC125_2: C125.2 R67.1 R70.2 U9.6(-)
NetC126_1: C126.1 R66.2 R72.1 U9.14(OUT)
NetC126_2: C126.2 R69.2 U9.13(-)
NetC127_1: C127.1 R70.1
NetC128_1: C128.1 R73.2 R74.1 R75.1
NetC128_2: C128.2 R66.1 R68.2 R69.1
NetC130_1: C130.1 R74.2 U9.12(+)
NetC141_1: C141.1 R57.1
NetC142_1: C142.1 R60.1
NetC143_1: C143.1 R68.1
NetC144_1: C144.1 R73.1

Not connected (* = marked no-connect by the designer): U8 13(ZEROR)* 14(ZEROL)*

### Notes on the sheet
- Input
- 24bit Audio Codec 2 IN, 2 OUT
- Output

### Library data of the parts
C119 C123 C126 C130 = Cap Semi: Capacitor; Fabricant: MULTICOMP; Fournisseur: Farnell; RefFabricant: MC0603B471K500CT; RefFournisseur: 1759079; Case: 0603 [1608 Metric]; DataSheet: http://www.farnell.com/datasheets/1901289.pdf
C120 C125 = Cap Semi: Capacitor; Fabricant: MULTICOMP; Fournisseur: Farnell; RefFabricant: MC0603B331K500CT; RefFournisseur: 1759075; Case: 0603 [1608 Metric]; DataSheet: http://www.farnell.com/datasheets/1901289.pdf
C121 C128 = Cap Semi: Capacitor; Fabricant: KEMET; Fournisseur: Farnell; RefFabricant: C0603C152K1RACAUTO; RefFournisseur: 2810266; Case: 0603 [1608 Metric]; DataSheet: http://www.farnell.com/datasheets/2048264.pdf
C122 C127 C131 C132 C134 C136 C139 C141-C144 = Cap Semi: as C178 on sheet PC4_AudioInput; Case: 0603 [1608 Metric]; DataSheet: http://www.farnell.com/datasheets/2291921.pdf
C124 C129 C133 C135 C137 C138 C140 = Cap Semi: as C185-C189 on sheet PC4_AudioInput; Case: 0603 [1608 Metric]
R56 R63 R66 R75 = Res3: Resistor; Fabricant: PANASONIC ELECTRONIC COMPONENTS; Fournisseur: Farnell; RefFabricant: ERA3AEB752V; RefFournisseur: 1670187; Case: 0603 [1608 Metric]; DataSheet: http://www.farnell.com/datasheets/2052875.pdf
R57 R60 R62 R67 R68 R73 = Res3: as R90 on sheet PC4_AudioInput; Case: 0603 [1608 Metric]; DataSheet: CRGH0603J10K
R58 R61 R69 R74 = Res3: Resistor; Fabricant: TE CONNECTIVITY; Fournisseur: Farnell; RefFabricant: CRGH0603J820R; RefFournisseur: 2331726; Case: 0603 [1608 Metric]; DataSheet: http://www.farnell.com/datasheets/2563624.pdf
R59 R72 = Res3: Resistor; Fabricant: TE CONNECTIVITY; Fournisseur: Farnell; RefFabricant: CRGS0603J100R; RefFournisseur: 2531678; Case: 0603 [1608 Metric]
R64 R70 = Res3: Resistor; Fabricant: PANASONIC ELECTRONIC COMPONENTS; Fournisseur: Farnell; RefFabricant: ERA3AEB203V; RefFournisseur: 1670194; Case: 0603 [1608 Metric]; DataSheet: http://www.farnell.com/datasheets/2052875.pdf
R65 R71 = Res3: as R117 on sheet PC5_AudioOutput; Case: 0603 [1608 Metric]; DataSheet: http://www.farnell.com/datasheets/2007183.pdf
U8 = PCM3060: Stereo In/Out Audio Codec; Fabricant: TEXAS INSTRUMENTS; RefFabricant: PCM3060PW; Fournisseur: Farnell; RefFournisseur: 1390706; Datasheet: http://www.ti.com/lit/ds/symlink/pcm3060.pdf
U9 = OPA1654: as U13 on sheet PC4_AudioInput; RefFabricant: OPA1654; DataSheet: http://www.ti.com/lit/ds/symlink/opa1654.pdf

## Nets that join several sheets
+1.1V_CORE: PA2_PMIC (C167.1 L7.2 U12.29), PP3_ptC_Alim (34 pins)
+1.1V_MPU: PA2_PMIC (C165.1 L6.2 U12.24), PP3_ptC_Alim (13 pins)
+1.5V_DDR: PP1_ptA_SRAM-NAND (39 pins), PA2_PMIC (C163.1 L5.2 U12.19), PP3_ptC_Alim (13 pins)
+1.8V_PMIC: PA2_PMIC (C169.2 U12.40), PP3_ptC_Alim (23 pins)
+1.8V_VLDO1: PP1_ptA_SRAM-NAND (U1.5), PA2_PMIC (5 pins), PP3_ptC_Alim (C106.2 U2.D7)
+3.3V_CORE: PP1_ptA_SRAM-NAND (8 pins), PP2_ptB (U5.5), PA2_PMIC (R82.2 R83.2 R84.2), PP6_LCD (23 pins), PP3_ptC_Alim (39 pins), PP8_MMC (5 pins)
+3.3VA: P0_Main_Connect (P3.3), PA1_Alim (C7.2 VR3.3), PC4_AudioInput (C187.1 U14.11 U14.14), PC5_AudioOutput (C208.1 R126.1 U16.11 U16.14), PC0_Codec (5 pins)
+5V: PA2_PMIC (R81.1), PP6_LCD (P7.1), PA1_Alim (C5.2 C6.2 VR2.4 VR3.1), PP5_MIDI (R79.2 U11.8)
+5VA: P0_Main_Connect (P3.1), PA1_Alim (C2.2 VR1.4), PC4_AudioInput (C185.1 C186.1 U13.4 U15.8), PC5_AudioOutput (C207.1 U17.4), PC0_Codec (6 pins)
-5V: P0_Main_Connect (P3.2), PA1_Alim (C12.2 VR4.4), PC4_AudioInput (C188.2 C189.2 U13.11 U15.4), PC5_AudioOutput (C209.2 U17.11), PC0_Codec (C139.2 C140.1 U9.11)
AGND: PC4_AudioInput (28 pins), PC5_AudioOutput (20 pins), PC0_Codec (15 pins)
GND: P0_Main_Connect (P1.16 P2.5 P2.6 P3.4), PP1_ptA_SRAM-NAND (63 pins), PP2_ptB (7 pins), PA2_PMIC (27 pins), PP6_LCD (24 pins), PP3_ptC_Alim (67 pins), PA1_Alim (18 pins), PP4_pD_GND (38 pins), PP5_MIDI (R80.1 U11.5), PP7_USB (C115.2 P6.4 U7.2), PP8_MMC (C117.1 C118.2 P9.6), PC4_AudioInput (5 pins), PC5_AudioOutput (C208.2 R127.1 R128.1 U16.4), PC0_Codec (5 pins)
GNDA_ADC: PP2_ptB (C47.2 C48.2 U2.A9), PP3_ptC_Alim (C104.2 C105.1 L3.2 U2.E8)
VDDA_ADC: PP2_ptB (C47.1 C48.1 U2.B9), PP3_ptC_Alim (C104.1 C105.2 L2.2 U2.D8)
Audio IN LEFT: P0_Main_Connect (P2.2), PC4_AudioInput (C194.1 R115.1), PC0_Codec (C122.2)
Audio IN RIGHT: P0_Main_Connect (P2.1), PC4_AudioInput (C180.1 R100.1), PC0_Codec (C127.2)
Audio OUT LEFT: P0_Main_Connect (P2.4 R1.1), PC0_Codec (R59.2)
Audio OUT RIGHT: P0_Main_Connect (P2.3 R2.1), PC0_Codec (R72.2)
DSP_Bypass: P0_Main_Connect (P1.15), PP1_ptA_SRAM-NAND (U2.C14)
EXTINT: PP1_ptA_SRAM-NAND (U2.B18), PA2_PMIC (R85.1 U12.45)
GPIO_Interrupt: P0_Main_Connect (P1.10), PP2_ptB (U2.L18)
I2C0_SCL: P0_Main_Connect (P1.11), PP2_ptB (U2.C16)
I2C0_SDA: P0_Main_Connect (P1.12), PP2_ptB (U2.C17)
I2C1_SCL: PP2_ptB (U2.D15), PA2_PMIC (R83.1 U12.28)
I2C1_SDA: PP2_ptB (U2.D16), PA2_PMIC (R84.1 U12.27)
I2C2_SCL: P0_Main_Connect (P1.13), PP2_ptB (U2.D17), PC4_AudioInput (U14.2), PC5_AudioOutput (U16.2)
I2C2_SDA: P0_Main_Connect (P1.14), PP2_ptB (U2.D18), PC4_AudioInput (U14.3), PC5_AudioOutput (U16.3)
LCD_B0: PP2_ptB (U2.U10), PP6_LCD (P7.21 P8.21)
LCD_B1: PP2_ptB (U2.U12), PP6_LCD (P7.22 P8.22)
LCD_B2: PP2_ptB (U2.V13), PP6_LCD (P7.23 P8.23)
LCD_B3: PP2_ptB (U2.U4), PP6_LCD (P7.24 P8.24 R31.1 R47.2)
LCD_B4: PP2_ptB (U2.V2), PP6_LCD (P7.25 P8.25 R32.1 R48.2)
LCD_B5: PP2_ptB (U2.V3), PP6_LCD (P7.26 P8.26 R33.1 R49.2)
LCD_B6: PP2_ptB (U2.V4), PP6_LCD (P7.27 P8.27 R34.1 R50.2)
LCD_B7: PP2_ptB (U2.T5), PP6_LCD (P7.28 P8.28 R35.1 R51.2)
LCD_BKL: PP2_ptB (U2.C18), PP6_LCD (P7.36 Q3.3 R16.2)
LCD_CLK: PP2_ptB (U2.V5), PP6_LCD (P7.31 P8.30)
LCD_DE: PP2_ptB (U2.R6), PP6_LCD (P7.32 P8.34)
LCD_G0: PP2_ptB (U2.T10), PP6_LCD (P7.13 P8.13)
LCD_G1: PP2_ptB (U2.T12), PP6_LCD (P7.14 P8.14)
LCD_G2: PP2_ptB (U2.T2), PP6_LCD (P7.15 P8.15 R25.1 R41.2)
LCD_G3: PP2_ptB (U2.T3), PP6_LCD (P7.16 P8.16 R26.1 R42.2)
LCD_G4: PP2_ptB (U2.T4), PP6_LCD (P7.17 P8.17 R27.1 R43.2)
LCD_G5: PP2_ptB (U2.U1), PP6_LCD (P7.18 P8.18 R28.1 R44.2)
LCD_G6: PP2_ptB (U2.U2), PP6_LCD (P7.19 P8.19 R29.1 R45.2)
LCD_G7: PP2_ptB (U2.U3), PP6_LCD (P7.20 P8.20 R30.1 R46.2)
LCD_HSYNC: PP2_ptB (U2.R5), PP6_LCD (P7.29 P8.32)
LCD_R0: PP2_ptB (U2.T11), PP6_LCD (P7.5 P8.5)
LCD_R1: PP2_ptB (U2.R12), PP6_LCD (P7.6 P8.6)
LCD_R2: PP2_ptB (U2.U13), PP6_LCD (P7.7 P8.7)
LCD_R3: PP2_ptB (U2.R1), PP6_LCD (P7.8 P8.8 R20.1 R36.2)
LCD_R4: PP2_ptB (U2.R2), PP6_LCD (P7.9 P8.9 R21.1 R37.2)
LCD_R5: PP2_ptB (U2.R3), PP6_LCD (P7.10 P8.10 R22.1 R38.2)
LCD_R6: PP2_ptB (U2.R4), PP6_LCD (P7.11 P8.11 R23.1 R39.2)
LCD_R7: PP2_ptB (U2.T1), PP6_LCD (P7.12 P8.12 R24.1 R40.2)
LCD_VSYNC: PP2_ptB (U2.U5), PP6_LCD (P7.30 P8.33)
LCD_X1: PP2_ptB (C43.2 U2.B6), PP6_LCD (P7.37 P8.37)
LCD_X2: PP2_ptB (C44.2 U2.C7), PP6_LCD (P7.39 P8.39)
LCD_Y1: PP2_ptB (C45.2 U2.B7), PP6_LCD (P7.38 P8.38)
LCD_Y2: PP2_ptB (C46.2 U2.A7), PP6_LCD (P7.40 P8.40)
LDO_PGOOD: PP1_ptA_SRAM-NAND (U2.B5), PA2_PMIC (U12.46)
McASP0_BCLK: PP2_ptB (U2.A13), PC0_Codec (U8.5 U8.10)
McASP0_LRCLK: PP2_ptB (U2.B13), PC0_Codec (U8.4 U8.11)
McASP0_MISO: PP2_ptB (U2.D13), PC0_Codec (U8.3)
McASP0_MOSI: PP2_ptB (U2.D12), PC0_Codec (U8.12)
McASP0_SCLK: PP2_ptB (U2.A14), PC0_Codec (U8.6 U8.9)
MIDI: PP2_ptB (U5.2), PP5_MIDI (R79.1 U11.6)
NetC172_2: PA2_PMIC (C172.2 D10.2 U12.38), PP6_LCD (Q4.3 R17.2)
NetC201_2: P0_Main_Connect (R2.2), PC5_AudioOutput (C201.2 R120.1)
NetC205_2: P0_Main_Connect (R1.2), PC5_AudioOutput (C205.2 R132.1)
NetP8_1: PA2_PMIC (U12.33 U12.34), PP6_LCD (P8.1)
PGOOD: PP1_ptA_SRAM-NAND (U1.2 U2.B15), PA2_PMIC (U12.26)
PWR_EN: PP2_ptB (U2.C6), PA2_PMIC (U12.9)
RST_ATMega: P0_Main_Connect (P1.6), PP1_ptA_SRAM-NAND (U2.B14)
SB_N: PP2_ptB (U2.N18), PP7_USB (P6.2 U7.6)
SB_P: PP2_ptB (U2.N17), PP7_USB (P6.3 U7.1)
SD_CLK: PP1_ptA_SRAM-NAND (U2.G17), PP8_MMC (P9.5)
SD_CMD: PP1_ptA_SRAM-NAND (U2.G18), PP8_MMC (P9.3 R52.2)
SD_DAT0: PP1_ptA_SRAM-NAND (U2.G16), PP8_MMC (P9.7 R53.2)
SD_DAT1: PP1_ptA_SRAM-NAND (U2.G15), PP8_MMC (P9.8 R54.2)
SD_DAT2: PP1_ptA_SRAM-NAND (U2.F18), PP8_MMC (P9.1 R55.2)
SD_DAT3: PP1_ptA_SRAM-NAND (U2.F17), PP8_MMC (P9.2)
SPI0_CS0: P0_Main_Connect (P1.3), PP2_ptB (U2.A16)
SPI0_CS1: P0_Main_Connect (P1.5), PP2_ptB (U2.C15)
SPI0_MISO: P0_Main_Connect (P1.2), PP2_ptB (U2.B17)
SPI0_MOSI: P0_Main_Connect (P1.4), PP2_ptB (U2.B16)
SPI0_SCLK: P0_Main_Connect (P1.1), PP2_ptB (U2.A17)
SPI1_CS0_Codec: PP2_ptB (U2.E17), PC0_Codec (U8.27)
SPI1_CS1_ATMega: P0_Main_Connect (P1.9), PP2_ptB (U2.A15)
SPI1_MOSI: PP2_ptB (U2.J15), PC0_Codec (U8.2)
SPI1_SCLK: PP2_ptB (U2.H16), PC0_Codec (U8.1)
UART_ATM-to-Proc: P0_Main_Connect (P1.8), PP2_ptB (U2.L17)
UART_Proc-to-ATM: P0_Main_Connect (P1.7), PP2_ptB (U2.L16)
USB0_VBUS: PP2_ptB (U2.P15), PP7_USB (C115.1 P6.1 U7.5)
WAKEUP: PP2_ptB (U2.C5), PA2_PMIC (R86.1 U12.13)